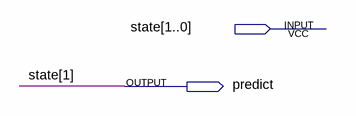
[diagram p0: schematic sheet]
// Quartus schematic Analizor.bdf as structural Verilog: 0 symbols, 2 pins
module Analizor (
  input  [1:0] state,
  output predict
);


  assign predict = state[1];
endmodule
